# EasyEDA Pro project ProPrj_主稳压电路_2025-12-27.epro, schematic Schematic1
Board Name: 稳压回路; Create Date: 2025-11-22; Page Name: P1; Project Name: zlwydy; Schematic Name: Schematic1; Update Date: 2025-12-15; BladeWidth: 10; Company: 嘉立创EDA; Page Size: A4; RegionStart: 1; ShowBorder: 1; TitleBlock: 1; TitleBlockPosition: 3; Version: V1.0; XRegionCount: 6; YRegionCount: 4
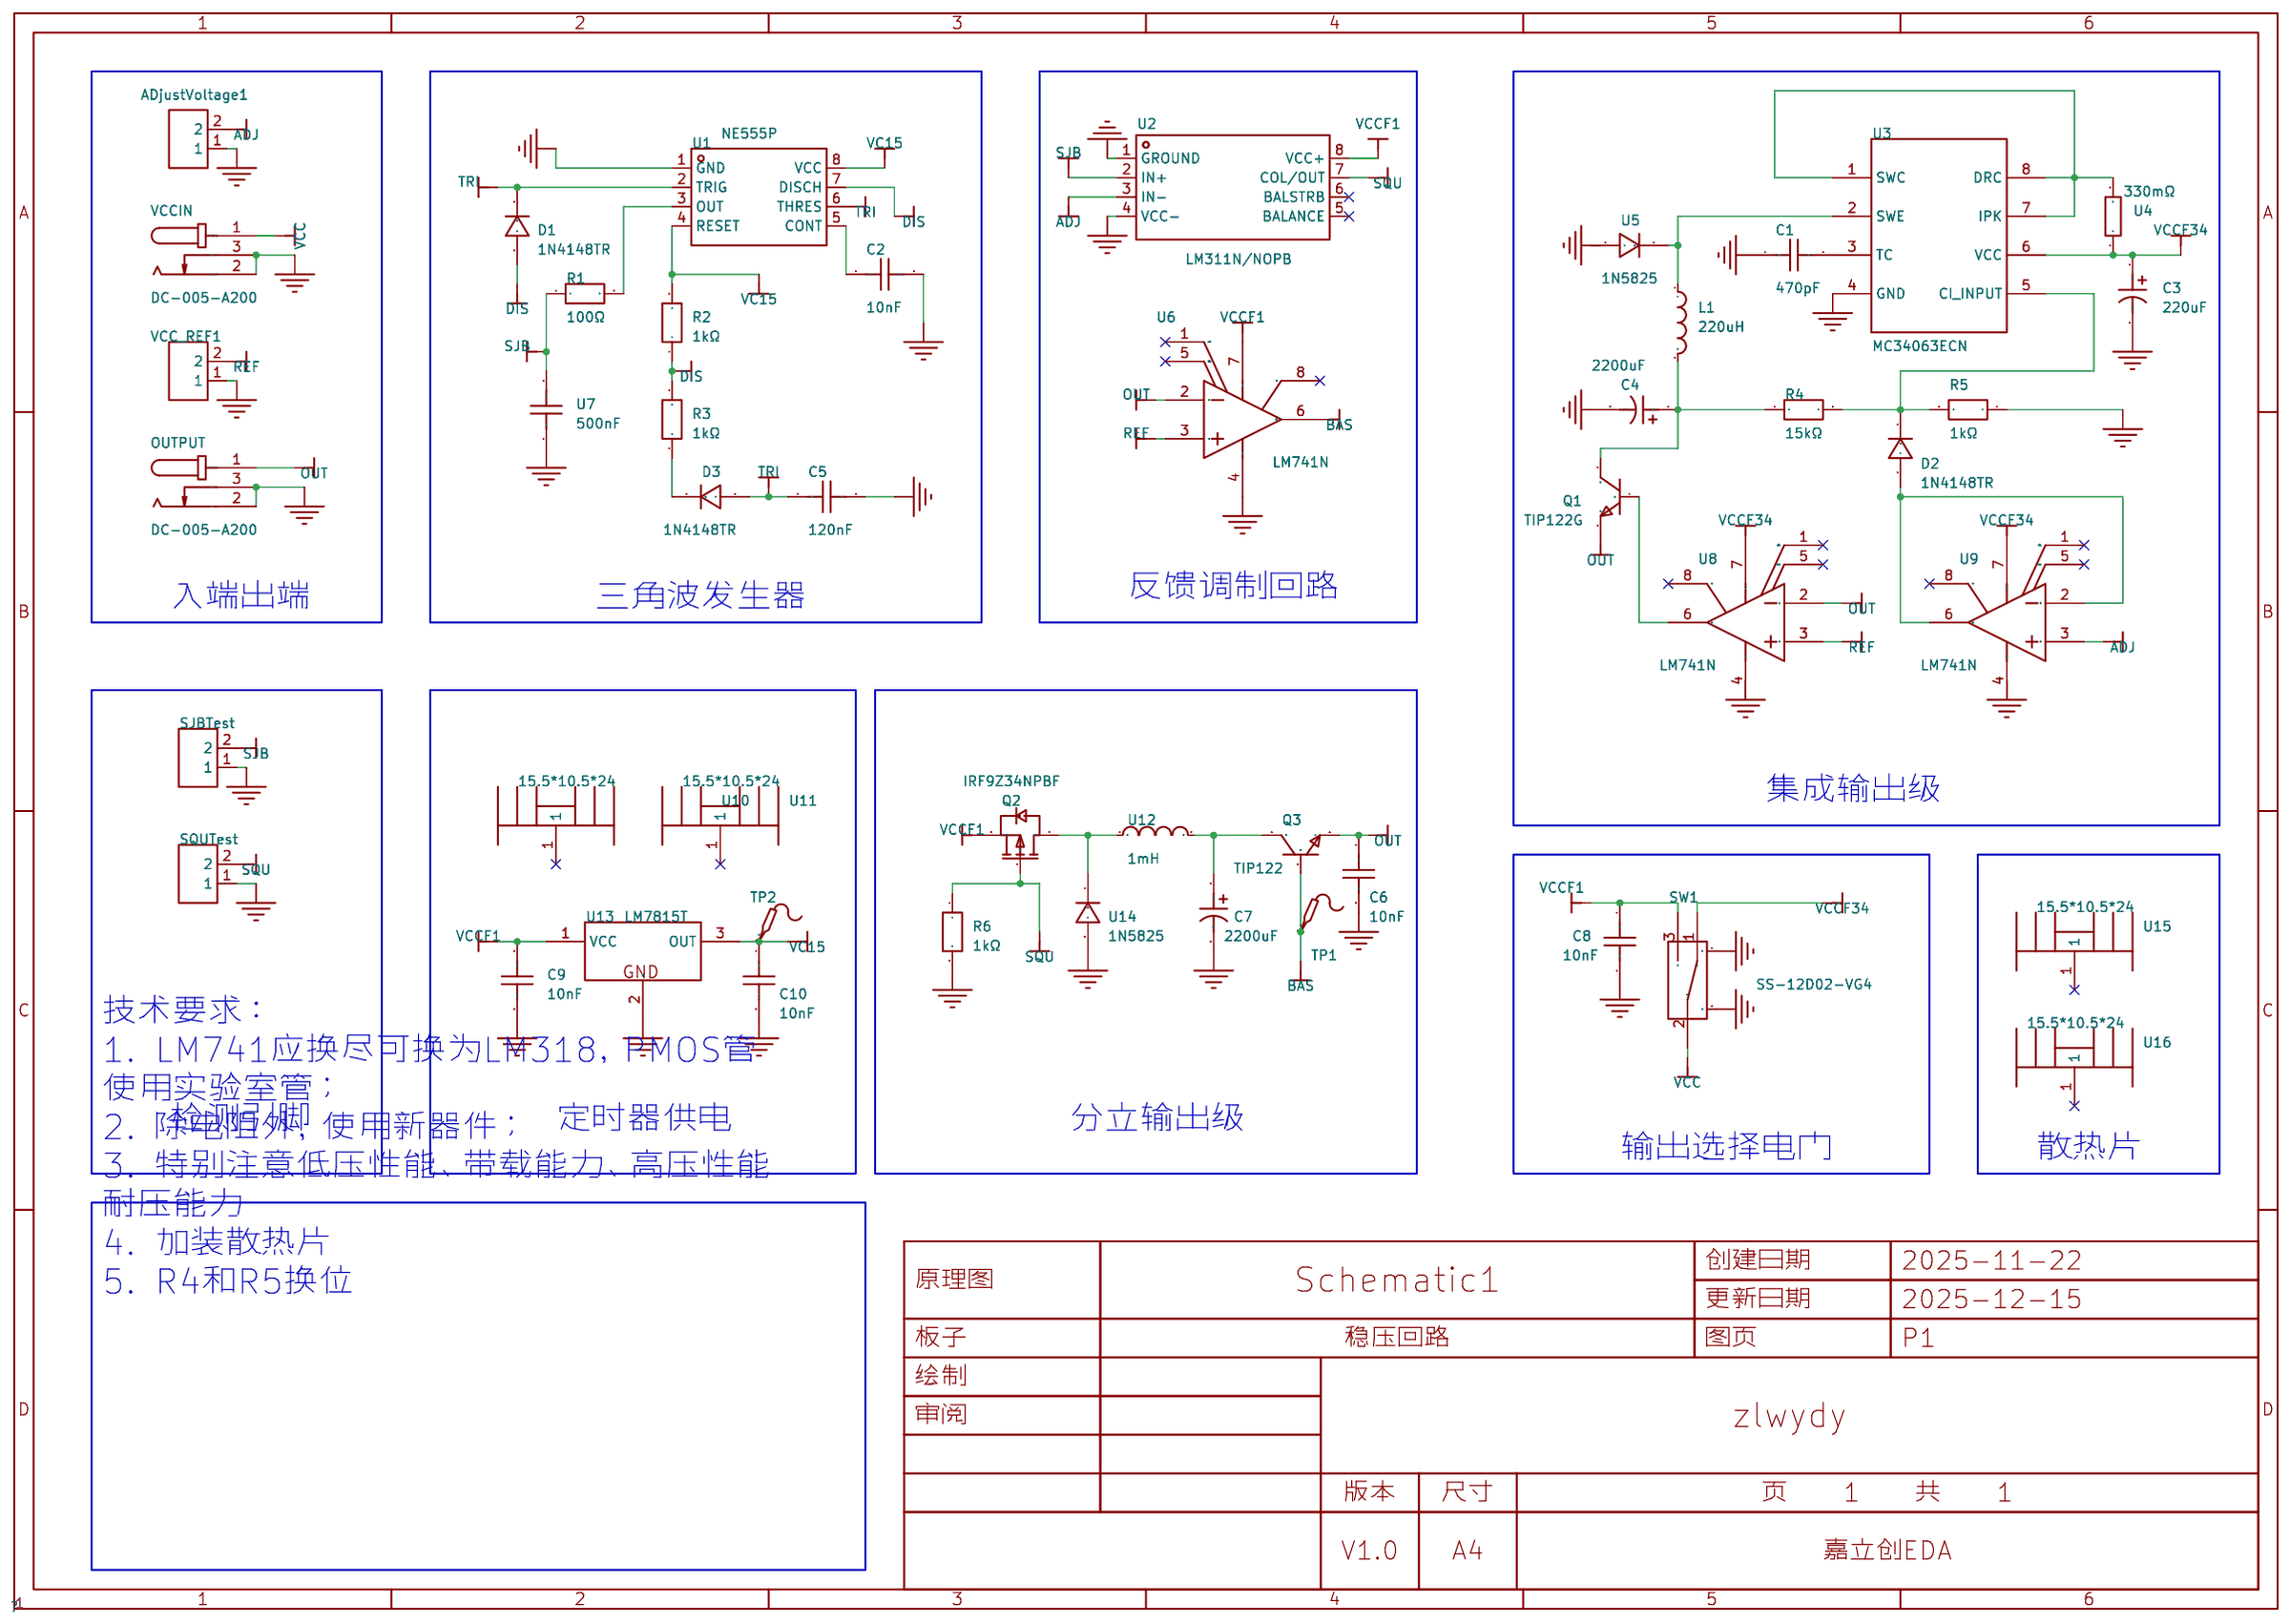
[diagram p0: schematic sheet]

## Parts
ADjustVoltage1  DB2EK-2.54-2P-GN-S  [CONN-TH_2P-P2.54_DB2EK-2.54-2P-GN]
C1  470pF  [CAP-TH_L5.0-W3.2-P5.08-D0.6]
C2  10nF  [CAP-TH_L4.2-W3.8-P2.54-D0.5]
C3  220uF  [CAP-TH_BD8.0-P3.50-D0.5-FD]
C4  2200uF  [CAP-TH_BD16.0-P7.50-D0.8-FD]
C5  120nF  [CAP-TH_L7.5-W4.5-P5.00-D0.5]
C6  10nF  [CAP-TH_L4.2-W3.8-P2.54-D0.5]
C7  2200uF  [CAP-TH_BD16.0-P7.50-D0.8-FD]
C8  10nF  [CAP-TH_L4.2-W3.8-P2.54-D0.5]
C9  10nF  [CAP-TH_L4.2-W3.8-P2.54-D0.5]
C10  10nF  [CAP-TH_L4.2-W3.8-P2.54-D0.5]
D1  1N4148TR  [DO-35_BD2.0-L4.2-P8.20-D0.5-RD]
D2  1N4148TR  [DO-35_BD2.0-L4.2-P8.20-D0.5-RD]
D3  1N4148TR  [DO-35_BD2.0-L4.2-P8.20-D0.5-RD]
L1  220uH  [IND-TH_BD7.0-P2.50-D0.7]
OUTPUT  DC-005-A200  [DC-IN-TH_DC-005-A200]
Q1  TIP122G  [TO-220-3_L10.0-W4.5-P2.54-L]
Q2  IRF9Z34NPBF  [TO-220-3_L10.0-W4.5-P2.54-L]
Q3  TIP122  [TO-220-3_L10.0-W4.5-P2.54-L]
R1  100Ω  [RES-TH_BD5.0-L15.5-P19.50-D0.8]
R2  1kΩ  [RES-TH_BD2.7-L6.2-P10.20-D0.4]
R3  1kΩ  [RES-TH_BD2.7-L6.2-P10.20-D0.4]
R4  15kΩ  [RES-TH_BD2.7-L6.2-P10.20-D0.4]
R5  1kΩ  [RES-TH_BD2.7-L6.2-P10.20-D0.4]
R6  1kΩ  [RES-TH_BD2.7-L6.2-P10.20-D0.4]
SJBTest  DB2EK-2.54-2P-GN-S  [CONN-TH_2P-P2.54_DB2EK-2.54-2P-GN]
SQUTest  DB2EK-2.54-2P-GN-S  [CONN-TH_2P-P2.54_DB2EK-2.54-2P-GN]
SW1  SS-12D02-VG4  [SW-TH_SS-12D02-VG4]
TP1  -  [Test-Point-0.5mm]
TP2  -  [Test-Point-0.5mm]
U1  NE555P  [DIP-8_L9.8-W6.6-P2.54-LS7.6-BL]
U2  LM311N/NOPB  [PDIP-8_L9.3-W6.4-P2.54-LS7.6-BL]
U3  MC34063ECN  [DIP-8_L9.8-W6.6-P2.54-LS7.6-BL]
U4  330mΩ  [RES-TH_BD5.0-L15.0-P19.00-D0.7]
U5  1N5825  [DO-201AD_BD5.0-L9.0-P13.00-D1.0]
U6  LM741N  [DIP-8_L9.3-W6.4-P2.54-LS7.6-BL]
U7  500nF  [CAP-TH_L9.5-W3.7-P7.50-D0.5]
U8  LM741N  [DIP-8_L9.3-W6.4-P2.54-LS7.6-BL]
U9  LM741N  [DIP-8_L9.3-W6.4-P2.54-LS7.6-BL]
U10  15.5*10.5*24  [HEATSINK-TH_L15.5-W10.5-XSD1226-005]
U11  15.5*10.5*24  [HEATSINK-TH_L15.5-W10.5-XSD1226-005]
U12  1mH  [IND-TH_BD9.5-P5.20-D0.6]
U13  LM7815T  [TO-220-3_L10.0-W4.5-P2.54-L]
U14  1N5825  [DO-201AD_BD5.0-L9.0-P13.00-D1.0]
U15  15.5*10.5*24  [HEATSINK-TH_L15.5-W10.5-XSD1226-005]
U16  15.5*10.5*24  [HEATSINK-TH_L15.5-W10.5-XSD1226-005]
VCC_REF1  DB2EK-2.54-2P-GN-S  [CONN-TH_2P-P2.54_DB2EK-2.54-2P-GN]
VCCIN  DC-005-A200  [DC-IN-TH_DC-005-A200]

## Library data of the parts
ADjustVoltage1 SJBTest SQUTest VCC_REF1 = DB2EK-2.54-2P-GN-S: 连接器类型:公插头;固定方式:-;结构:1x2P;间距:2.54mm;颜色:绿色;安装方式:-;排数:1;每排PIN数:2;额定电流:5A;额定电压:320V;线规 - AWG:20~26;线规 - 平方毫米:0.5;工作温度:-40℃~+105℃;; LCSC Part Name: 1x2P 2.54mm 排数:1 每排P数:2; Supplier Part: C2927483; Manufacturer: DORABO(地博电气); Supplier Footprint: P=2.54mm; JLCPCB Part Class: 扩展库; Datasheet: https://item.szlcsc.com/datasheet/DB2EK-2.54-2P-GN-S/3255019.html; Supplier: LCSC; Connector Type: 公插头; Number of Positions or Pins: 1x2P; Pitch: 2.54mm; Color: 绿色; Number of Pins: 2P; Number of Rows: 1; Number of PINs Per Row: 2; Current Rating: 5A; Voltage Rating (Max): 320V; Wire Gauge - AWG: 20~26; Wire Gauge - mm2: 0.5; Operating Temperature: -40℃~+105℃; Connection Type: 螺钉连接(M1.6); Outlet Direction (Vertical Basis): 顶部出线
C1 = CD1H471JC0IECHE100: 容值:470pF;精度:±5%;额定电压:50V;温度系数:NP0;; LCSC Part Name: 470pF ±5% 50V; Supplier Part: C2761751; Manufacturer: Dersonic(德尔创); Supplier Footprint: 插件,P=5.08mm; JLCPCB Part Class: 扩展库; Datasheet: https://item.szlcsc.com/datasheet/CD1H471JC0IECHE100/2886498.html; Supplier: LCSC; Tolerance: ±5%; Voltage Rating: 50V; Temperature Coefficient: NP0
C2 C6 C8-C10 = CT4-0805B103K500F1: 容值:10nF;精度:±10%;额定电压:50V;温度系数:X7R;; LCSC Part Name: 10nF ±10% 50V; Supplier Part: C169112; Manufacturer: FH(风华); Supplier Footprint: 插件,P=2.54mm; JLCPCB Part Class: 扩展库; Datasheet: https://item.szlcsc.com/datasheet/CT4-0805B103K500F1/180497.html; Supplier: LCSC; Tolerance: ±10%; Voltage Rating: 50V; Temperature Coefficient: X7R
C3 = ERA35V220M8X12: 容值:220uF;精度:±20%;额定电压:35V;; LCSC Part Name: 220uF ±20% 35V; Supplier Part: C49256804; Manufacturer: JIERR(捷而瑞); Supplier Footprint: 插件,D8xL12mm; JLCPCB Part Class: 扩展库; Datasheet: https://item.szlcsc.com/datasheet/ERA35V220M8X12/51692204.html; Supplier: LCSC; Tolerance: ±20%; Voltage Rating: 35V; Pin Spacing: 3.5mm; Diameter: 8mm; Height - Seated (Max): 12mm; Lifetime: 2000hrs@105℃; Operating Temperature: -40℃~+105℃
C4 C7 = ERA50V2200M16X30: 容值:2200uF;精度:±20%;额定电压:50V;; LCSC Part Name: 2200uF ±20% 50V; Supplier Part: C49256818; Manufacturer: JIERR(捷而瑞); Supplier Footprint: 插件,D16xL30mm; JLCPCB Part Class: 扩展库; Datasheet: https://item.szlcsc.com/datasheet/ERA50V2200M16X30/51692218.html; Supplier: LCSC; Tolerance: ±20%; Voltage Rating: 50V; Pin Spacing: 7.5mm; Diameter: 16mm; Height - Seated (Max): 30mm; Lifetime: 2000hrs@105℃; Operating Temperature: -40℃~+105℃
C5 = W222A124JD5L00A00A: 容值:120nF;精度:±5%;额定电压:100V;介电材料:金属化聚酯;; LCSC Part Name: 120nF ±5% 100V; Supplier Part: C7502407; Manufacturer: WEIDY(纬迪); Supplier Footprint: 插件,P=5mm; JLCPCB Part Class: Extended Part; Datasheet: https://item.szlcsc.com/datasheet/W222A124JD5L00A00A/8587658.html; Supplier: LCSC; Tolerance: ±5%; Voltage Rating: 100V; Dielectric Material: 金属化聚酯
D1-D3 = 1N4148TR_C84410: 二极管配置:-;正向压降(Vf):1V@10mA;直流反向耐压(Vr):100V;整流电流:200mA;反向恢复时间(Trr):4ns;; Supplier Part: C84410; Manufacturer: onsemi(安森美); Supplier Footprint: DO-35; JLCPCB Part Class: 扩展库; Datasheet: https://item.szlcsc.com/datasheet/1N4148TR/85580.html; Supplier: LCSC; Voltage - Forward(Vf@If): 1V@10mA; Voltage - DC Reverse(Vr): 100V; Current - Rectified: 200mA; Pd - Power Dissipation: 500mW; Reverse Leakage Current (Ir): 5uA@75V; Reverse Recovery Time (trr): 4ns; Operating Junction Temperature Range: -55℃~+175℃@(Tj); Non-Repetitive Peak Forward Surge Current: 4A
L1 = PK0608-221MB: 电感值:220uH;精度:±20%;额定电流:440mA;类型:非屏蔽电感;; LCSC Part Name: 220uH ±20%; Supplier Part: C400304; Manufacturer: SXN(顺翔诺); Supplier Footprint: 插件,D7.5xL11mm; JLCPCB Part Class: 扩展库; Datasheet: https://item.szlcsc.com/datasheet/PK0608-221MB/384135.html; Supplier: LCSC; Tolerance: ±20%; Current Rating: 440mA; DC Resistance(DCR): 900mΩ; Type: 非屏蔽电感
OUTPUT VCCIN = DC-005-A200: 连接器类型:DC电源插座;安装方式:弯插;触点内径:2mm;触点外径:6.4mm;额定电流:3A;额定电压:30V;工作温度:-20℃~+70℃;; LCSC Part Name: DC电源插座 内径:2mm 外径:6.4mm; Supplier Part: C720557; Manufacturer: XUNPU(讯普); Supplier Footprint: 插件; JLCPCB Part Class: 扩展库; Datasheet: https://item.szlcsc.com/datasheet/DC-005-A200/763564.html; Supplier: LCSC; Connector Type: DC电源插座; Mounting Type: 弯插; Inside Contact Diameter: 2mm; Outside Contact Diameter: 6.4mm; Current Rating: 3A; Voltage Rating (Max): 30V; Operating Temperature: -20℃~+70℃
Q1 = TIP122G: 类型:NPN;集射极击穿电压(Vceo):100V;直流电流增益(hFE):1000;耗散功率(Pd):2W;集电极电流(Ic):5A;; Supplier Part: C897224; Manufacturer: onsemi(安森美); Supplier Footprint: TO-220AB; JLCPCB Part Class: 扩展库; Datasheet: https://item.szlcsc.com/datasheet/TIP122G/962661.html; Supplier: LCSC; Type: NPN; Collector - Emitter Voltage VCEO: 100V; DC Current Gain: 1000; Pd - Power Dissipation: 2W; Current - Collector(Ic): 5A; Operating Temperature: -65℃~+150℃@(Tj)
Q2 = IRF9Z34NPBF: 类型:1个P沟道;漏源电压(Vdss):55V;连续漏极电流(Id):19A;导通电阻(RDS(on)@Vgs,Id):100mΩ@10V,10A;功率(Pd):68W;阈值电压(Vgs(th)@Id):2V@250uA;; LCSC Part Name: 1个P沟道 耐压:55V 电流:19A; Supplier Part: C500523; Manufacturer: Infineon(英飞凌); Supplier Footprint: TO-220AB; JLCPCB Part Class: 扩展库; Datasheet: https://atta.szlcsc.com/upload/public/pdf/source/20200323/C500523_6BB56CB60E6F65FF7BB9B42200B3C1E7.pdf; Supplier: LCSC; Type: 1个P沟道; Drain Source Voltage (Vdss): 55V; Continuous Drain Current (Id): 19A; Drain Source On Resistance (RDS(on)@Vgs,Id): 100mΩ@10V,10A; Power Dissipation (Pd): 68W; Gate Threshold Voltage (Vgs(th)@Id): 2V@250uA; Total Gate Charge (Qg@Vgs): 35nC; Input Capacitance (Ciss@Vds): 620pF; Reverse Transfer Capacitance (Crss@Vds): 140pF; Operating Temperature: -55℃~+175℃
Q3 = TIP122_C41381874: 这款NPN型三极管（BJT）的最大集电极电流IC为5A，适用于中等电流需求的应用。其VCEO（集电极-发射极击穿电压）为100V，能够在较高电压条件下稳定工作。在3A集电极电流和3V电压条件下，该三极管的HFE（电流增益）范围为1K至12K，提供了稳定的电流放大性能。此元件适用于多种电子设备中的信号放大与开关应用，如消费电子产品的电路设计。; LCSC Part Name: NPN 电流:5A 电压:100V; Supplier Part: C41381874; Manufacturer: HXY MOSFET(华轩阳电子); Supplier Footprint: TO-220S; JLCPCB Part Class: 扩展库; Datasheet: https://item.szlcsc.com/datasheet/TIP122/43164807.html; Supplier: LCSC
R1 = MF3WS-100Ω±1%T: 电阻类型:金属膜电阻;阻值:100Ω;精度:±1%;功率:3W;温度系数:±200ppm/℃;; LCSC Part Name: 金属膜电阻 100Ω ±1% 3W; Supplier Part: C714177; Manufacturer: 华星机电; Supplier Footprint: 插件,D5xL15.5mm; JLCPCB Part Class: 扩展库; Datasheet: https://item.szlcsc.com/datasheet/MF3WS-100%25CE%25A9%25C2%25B11%2525T/754502.html; Supplier: LCSC; Type: 金属膜电阻; Tolerance: ±1%; Power(Watts): 3W; Temperature Coefficient: ±200ppm/℃
R2 R3 R5 R6 = MF1/4W-1K±1%-ST52: 电阻类型:金属膜电阻;阻值:1kΩ;精度:±1%;功率:250mW;温度系数:±100ppm/℃;; LCSC Part Name: 金属膜电阻 1kΩ ±1% 250mW; Supplier Part: C2903245; Manufacturer: VO(翔胜); Supplier Footprint: 插件,D2.7xL6.2mm; JLCPCB Part Class: 扩展库; Datasheet: https://item.szlcsc.com/datasheet/MF1%252F4W-1K%25C2%25B11%2525-ST52/3158996.html; Supplier: LCSC; Type: 金属膜电阻; Tolerance: ±1%; Voltage-Supply(Max): 250V; Power(Watts): 250mW; Temperature Coefficient: ±100ppm/℃; Operating Temperature: -55℃~+155℃
R4 = MF1/4W-15K±1%-ST26: 电阻类型:金属膜电阻;阻值:15kΩ;精度:±1%;功率:250mW;温度系数:±100ppm/℃;; LCSC Part Name: 金属膜电阻 15kΩ ±1% 250mW; Supplier Part: C2903263; Manufacturer: VO(翔胜); Supplier Footprint: 插件,D2.7xL6.2mm; JLCPCB Part Class: 扩展库; Datasheet: https://item.szlcsc.com/datasheet/MF1%252F4W-15K%25C2%25B11%2525-ST26/3159014.html; Supplier: LCSC; Type: 金属膜电阻; Tolerance: ±1%; Voltage-Supply(Max): 250V; Power(Watts): 250mW; Temperature Coefficient: ±100ppm/℃; Operating Temperature: -55℃~+155℃
SW1 = SS-12D02-VG4_C136719: 电路结构:单刀双掷;安装方式:直插;额定电流:-;额定电压:-;工作寿命:5千次;; LCSC Part Name: 直插双档 滑动开关; Supplier Part: C136719; Manufacturer: 韩国韩荣; Supplier Footprint: 插件; JLCPCB Part Class: 扩展库; Datasheet: https://item.szlcsc.com/datasheet/SS-12D02-VG4/148035.html; Supplier: LCSC; Circuit: 单刀双掷; Actuator Style: 矩形柱状; Termination Style: PC引脚; Switch Height: 8.7mm; Mounting Type: 直插; Life: 5千次; Operating Temperature: -25℃~+70℃
TP1 TP2 = Test-Point: Test Point 测试点
U1 = NE555P: 这些器件是精密定时电路，能够产生精确的时间延迟或振荡。在延时或单稳态工作模式下，定时时间间隔由单个外部电阻和电容网络控制。在无稳态工作模式下，频率和占空比可通过两个外部电阻和一个外部电容分别控制; Supplier Part: C46749; Manufacturer: TI(德州仪器); Supplier Footprint: DIP-8; JLCPCB Part Class: 扩展库; Datasheet: https://www.ti.com/cn/lit/gpn/ne555; Supplier: LCSC
U2 = LM311N/NOPB: 比较器数:单路;输入失调电压(Vos):2mV;输入偏置电流(Ib):100nA;; Supplier Part: C99439; Manufacturer: TI(德州仪器); Supplier Footprint: PDIP-8; JLCPCB Part Class: 扩展库; Datasheet: https://www.ti.com/cn/lit/gpn/lm311-n; Supplier: LCSC; Number of Channels: 单路; Vos - Input Offset Voltage: 2mV; Ib - Input Bias Current: 100nA; Propagation Delay Time: 200ns; Output Type: CMOS；TTL; Quiescent Current: 5.1mA; Operating Temperature: 0℃~+70℃
U3 = MC34063ECN: 功能类型:升压型；降压型;输出类型:可调;输入电压:3V~40V;输出电压:1.25V~38V;输出电流:1.5A;; LCSC Part Name: MC34063A/E系列DC-DC转换器控制电路; Supplier Part: C5180; Manufacturer: ST(意法半导体); Supplier Footprint: DIP-8; JLCPCB Part Class: 扩展库; Datasheet: https://atta.szlcsc.com/upload/public/pdf/source/20120402/1457706462623.pdf; Supplier: LCSC; Function: 升压型；降压型; Output Type: 可调; Input Voltage: 3V~40V; Output Voltage: 1.25V~38V; Output Current: 1.5A; Switching Frequency: 33kHz; Operating Temperature: 0℃~+70℃@(TA); Synchronous Rectification: 否; Number of Outputs: 1; Topology: 升压式；降压式; Switch tube (built-in/external): 内置
U4 = MF3WS-0Ω33±1%-9T73: 电阻类型:金属膜电阻;阻值:330mΩ;精度:±1%;功率:3W;温度系数:±400ppm/℃;; LCSC Part Name: 金属膜电阻 330mΩ ±1% 3W; Supplier Part: C2843049; Manufacturer: VO(翔胜); Supplier Footprint: 插件,D5xL15mm; JLCPCB Part Class: 扩展库; Datasheet: https://atta.szlcsc.com/upload/public/pdf/source/20200609/C601728_5AA4C0C8E12E11069DA2C3356F29D1F2.pdf; Supplier: LCSC; Type: 金属膜电阻; Tolerance: ±1%; Overload Voltage (Max): 500V; Power(Watts): 3W; Temperature Coefficient: ±400ppm/℃; Operating Temperature Range: -55℃~+155℃
U5 U14 = 1N5825_C5338483: 正向压降(Vf):550mV@5A;直流反向耐压(Vr):40V;整流电流:5A;; LCSC Part Name: 电压:40V 电流:5A; Supplier Part: C5338483; Manufacturer: SUNMATE(森美特); Supplier Footprint: DO-27; JLCPCB Part Class: 扩展库; Datasheet: https://item.szlcsc.com/datasheet/1N5825/6106201.html; Supplier: LCSC; Voltage - Forward(Vf@If): 550mV@5A; Voltage - DC Reverse(Vr): 40V; Current - Rectified: 5A; Reverse Leakage Current (Ir): 500uA@40V; Operating Junction Temperature Range: -65℃~+150℃; Non-Repetitive Peak Forward Surge Current: 150A
U6 U8 U9 = LM741N: 放大器数:单路;轨到轨:-;增益带宽积(GBP):1.5MHz;输入失调电压(Vos):5mV;压摆率(SR):500V/ms;输入偏置电流(Ib):500nA;; LCSC Part Name: LM741通用运算放大器; Supplier Part: C22446595; Manufacturer: HGSEMI(华冠); Supplier Footprint: DIP-8; JLCPCB Part Class: 扩展库; Datasheet: https://item.szlcsc.com/datasheet/LM741N/24099143.html; Supplier: LCSC; Number of Channels: 单路; Maximum Power Supply Range (Vdd-Vss): 36V; Gain Bandwidth Product: 1.5MHz; Vos - Input Offset Voltage: 5mV; Input Offset Voltage Drift(Vos TC): 15uV/℃; Slew Rate: 500V/ms; Ib - Input Bias Current: 500nA; Input Offset Current(Ios): 200nA; Common Mode Rejection Ratio(CMRR): 90dB; Quiescent Current: 1.7mA; Output Current: 25mA; Operating Temperature: 0℃~+70℃; Dual Supply: -15V~15V
U7 = MPP504J2A0702: 容值:500nF;精度:±5%;额定电压:100V;工作温度:-40℃~+105℃;; LCSC Part Name: 500nF ±5% 100V 100KHZ测试 用于无线充电源; Supplier Part: C3019097; Manufacturer: KYET(科雅); Supplier Footprint: 插件,P=7.5mm; JLCPCB Part Class: 扩展库; Datasheet: https://item.szlcsc.com/datasheet/MPP504J2A0702/3534062.html; Supplier: LCSC; Tolerance: ±5%; Voltage Rating: 100V; Operating Temperature: -40℃~+105℃
U10 U11 U15 U16 = 15.5*10.5*24: 产品尺寸:15.5*10.5*24MM;材 质:6063-T5;; LCSC Part Name: 散热片15.5*10.5*24 带针 H型; Supplier Part: C108928; Manufacturer: XSD(鑫顺达); JLCPCB Part Class: 扩展库; Datasheet: https://atta.szlcsc.com/upload/public/pdf/source/20180614/C108928_606EC6D8E4D943F4065E73A7656775A1.pdf; Supplier: LCSC; ProductSize: 15.5*10.5*24MM; Colour: 白色; TextureOfMaterial: 6063-T5; SurfaceTreatment: 本色洗白; Shape: H型; type: -；-；-；-；-；-；-
U12 = PDPTAT0810-102K: 电感值:1mH;精度:±10%;额定电流:250mA;饱和电流(Isat):400mA;类型:工字电感;品质因数:-;; Supplier Part: C2915649; Manufacturer: PROD(谱罗德); Supplier Footprint: 插件,D9.5xL12mm; JLCPCB Part Class: 扩展库; Datasheet: https://item.szlcsc.com/datasheet/PDPTAT0810-102K/3209627.html; Supplier: LCSC; Tolerance: ±10%; Current Rating: 250mA; Current - Saturation(Isat): 400mA; DC Resistance(DCR): 1.26Ω; Type: 工字电感
U13 = LM7815T: 输出类型:固定;工作电压:35V;输出电压:15V;输出电流:-;电源纹波抑制比(PSRR):54dB@(120Hz);输出极性:正极;; LCSC Part Name: 三端固定正稳压电路; Supplier Part: C507139; Manufacturer: HGSEMI(华冠); Supplier Footprint: TO-220; JLCPCB Part Class: 扩展库; Datasheet: https://atta.szlcsc.com/upload/public/pdf/source/20240307/E28367F2CC2BC825DF756EF02CE1AF99.pdf; Supplier: LCSC; Output Type: 固定; Voltage - Supply: 35V; Output Voltage: 15V; Power Supply Rejection Ratio (PSRR): 54dB@(120Hz); Features: 短路保护(SCP)；热关断(TSD); Operating Temperature: 0℃~+125℃@(Ta); Output Configuration: 正极; Number of Outputs: 1

## Nets
GND: ADjustVoltage1.1 C1.1 C2.2 C3.2 C4.2 C5.2 C6.2 C7.2 C8.2 C9.2 C10.2 OUTPUT.2 OUTPUT.3 R5.1 R6.2 SJBTest.1 SQUTest.1 SW1.4 SW1.5 U1.1(GND) U2.1(GROUND) U2.4(VCC-) U3.4(GND) U5.2(A) U6.4(V-) U7.1 U8.4(V-) U9.4(V-) U13.2(GND) U14.2(A) VCC_REF1.1 VCCIN.2 VCCIN.3
VCC: SW1.2 VCCIN.1
VCCF1: C8.1 C9.1 Q2.3(S) SW1.3 U2.8(VCC+) U6.7(V+) U13.1(VCC)
VCCF34: C3.1 SW1.1 U3.6(VCC) U4.1 U8.7(V+) U9.7(V+)
ADJ: ADjustVoltage1.2 U2.3(IN-) U9.3(+IN)
BAS: Q3.1(B) TP1.1 U6.6(OUT)
DIS: D1.2(A) R2.1 R3.2 U1.7(DISCH)
OUT: C6.1 OUTPUT.1 Q1.3(E) Q3.3(E) U6.2(-IN) U8.2(-IN)
REF: U6.3(+IN) U8.3(+IN) VCC_REF1.2
SJB: R1.1 SJBTest.2 U2.2(IN+) U7.2
SQU: Q2.1(G) R6.1 SQUTest.2 U2.7(COL/OUT)
TRI: C5.1 D1.1(C) D3.2(A) U1.2(TRIG) U1.6(THRES)
VC15: C10.1 R2.2 TP2.1 U1.4(RESET) U1.8(VCC) U13.3(OUT)
$1N5771: R1.2 U1.3(OUT)
$1N5830: C2.1 U1.5(CONT)
$1N6011: D3.1(C) R3.1
$1N11989: C7.1 Q3.2(C) U12.2
$1N12066: Q2.2(D) U12.1 U14.1(C)
$1N13805: U3.1(SWC) U3.7(IPK) U3.8(DRC) U4.2
$1N13870: C1.2 U3.3(TC)
$1N14029: L1.1 U3.2(SWE) U5.1(C)
$1N14605: D2.2(A) U9.2(-IN) U9.6(OUT)
$1N14798: D2.1(C) R4.2 R5.2 U3.5(CI INPUT)
$1N14804: C4.1 L1.2 Q1.2(C) R4.1
$1N14946: Q1.1(B) U8.6(OUT)

Not connected (* = marked no-connect by the designer): U2 5(BALANCE)* 6(BALSTRB)*; U6 1(OFFSET NULL)* 5(OFFSET NULL)* 8(NC)*; U8 1(OFFSET NULL)* 5(OFFSET NULL)* 8(NC)*; U9 1(OFFSET NULL)* 5(OFFSET NULL)* 8(NC)*; U10 1*; U11 1*; U15 1*; U16 1*

## Notes on the sheet
- 入端出端
- 三角波发生器
- 反馈调制回路
- 集成输出级
- 技术要求：
  1. LM741应换尽可换为LM318，PMOS管
  使用实验室管；
  2. 除电阻外，使用新器件；
  3. 特别注意低压性能、带载能力、高压性能
  耐压能力
  4. 加装散热片
  5. R4和R5换位
- 检测引脚
- 定时器供电
- 分立输出级
- 输出选择电门
- 散热片
